# Altium schematic sheet 28pins_schematic.SchDoc (part 3 of 3)
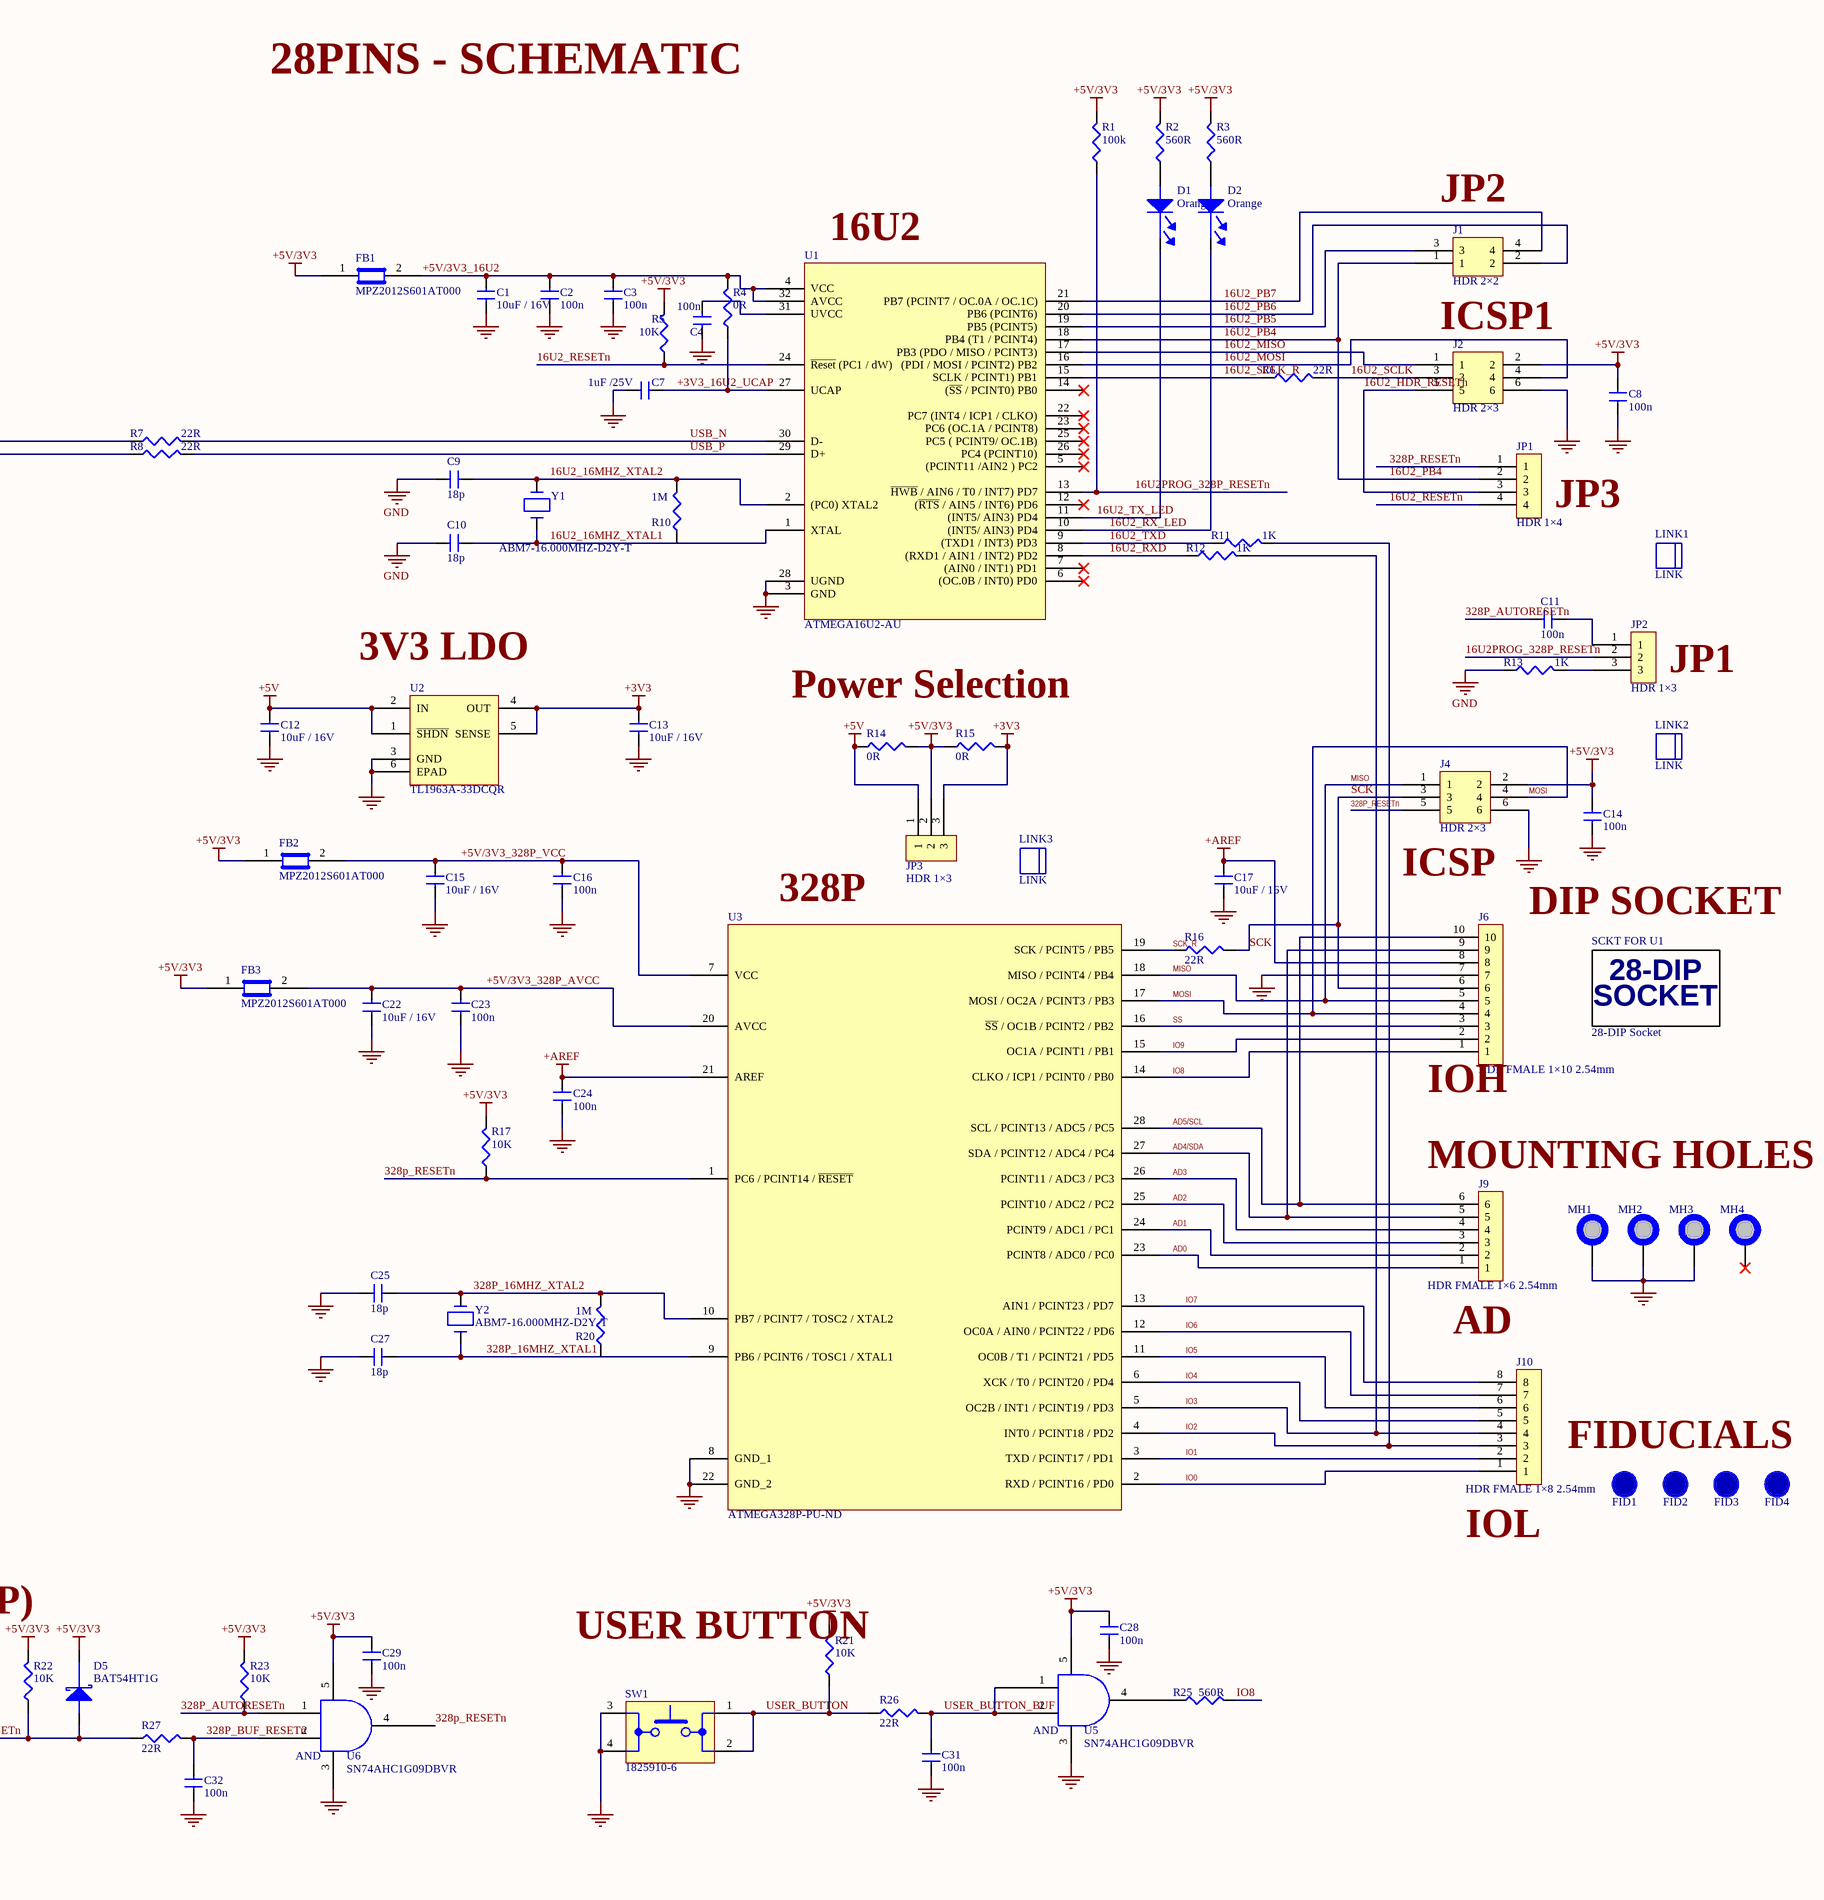
[diagram p3: 28pins_schematic.SchDoc, right]

## Library data of the parts (continued)
SW1 SW2 = 1825910-6: Alcoswitch, Switch, Pushbutton, Tactile, SPST, 50mA, Thru Hole, 6mm; Manufacturer: TE Connectivity Alcoswitch; Categories: Switches; Circuit: SPST-NO; Switch Function: Off-Mom; Contact Rating @ Voltage: 0.05A @ 24VDC; Actuator Type: Standard; Actuator Height off PCB, Vertical: 5.00mm; Actuator Orientation: Top Actuated; Outline: 6.00mm x 6.00mm; Illumination: Non-Illuminated; Operating Force: 160gf; Actuator Material: Polybutylene Terephthalate (PBT); Switch Travel: 0.25mm; Mechanical Life: 100,000 Cycles; Supplier 1: Digikey; Manufacturer Part Number: 1825910-6; Stock 1: 36154; Pricing 1: 1=0.13, 10=0.125, 25=0.1184, 100=0.1078, 250=0.1013, 750=0.0927, 1500=0.0776, 3000=0.0754, 5250=0.0711 (USD); Series: FSMJ; Packaging: Bulk; Part Status: Active; Mounting Type: Through Hole; Actuator Length, Right Angle: -; Termination Style: PC Pin; Illumination Type, Color: -; Illumination Voltage (Nominal): -; Ingress Protection: -; Features: -; Operating Temperature: -35°C ~ 85°C; ComponentLink1URL: https://datasheet.ciiva.com/30199/1825910-6rqpn1825910-6-30199520.pdf?src-supplier=Onlinecomponents.com; ComponentLink1Description: https://datasheet.ciiva.com/30199/1825910-6rqpn1825910-6-30199520.pdf?src-supplier=Onlinecomponents.com; ComponentLink2URL: https://datasheet.ciiva.com/15184/getdatasheetpartid-395915-15184509.pdf?src-supplier=Verical; ComponentLink2Description: https://datasheet.ciiva.com/15184/getdatasheetpartid-395915-15184509.pdf?src-supplier=Verical; Supplier Part Number 1: 450-1650-ND
U1 = ATMEGA16U2-AUR (2): Risc Microcontroller, 8-BIT, Flash, AVR Risc Cpu, 16MHZ, Cmos, PQFP32; Manufacturer: Microchip; Categories: Integrated Circuits (ICs); Connectivity: SPI, UART/USART, USB; Peripherals: Brown-out Detect/Reset, POR, PWM, WDT; Number of I/O: 22; Program Memory Size: 16KB (8K x 16); EEPROM Size: 512 x 8; Voltage - Supply (Vcc/Vdd): 2.7V ~ 5.5V; Oscillator Type: Internal; Supplier 1: Digikey; Manufacturer Part Number: ATMEGA16U2-AUR; Stock 1: 10662; Pricing 1: 1=3.34, 25=3.06, 100=2.75 (USD); Series: AVR® ATmega; Packaging: Digi-Reel®; Part Status: Active; Core Processor: AVR; Core Size: 8-Bit; Speed: 16MHz; Program Memory Type: FLASH; RAM Size: 512 x 8; Data Converters: -; Operating Temperature: -40°C ~ 85°C; Mounting Type: Surface Mount; Package / Case: 32-TQFP; Supplier Device Package: 32-TQFP (7x7); Base Part Number: ATMEGA16U2; ComponentLink1URL: http://www.microchip.com/mymicrochip/filehandler.aspx?ddocname=en590463&src-supplier=Digikey; ComponentLink1Description: http://www.microchip.com/mymicrochip/filehandler.aspx?ddocname=en590463&src-supplier=Digikey; ComponentLink2URL: https://datasheet.octopart.com/ATMEGA16U2-AUR-Microchip-datasheet-14435305.pdf?src-supplier=Electro+Sonic; ComponentLink2Description: https://datasheet.octopart.com/ATMEGA16U2-AUR-Microchip-datasheet-14435305.pdf?src-supplier=Electro+Sonic; Supplier Part Number 1: ATMEGA16U2-AURCT-ND
U2 = TL1963A-33DCQR: LDO Regulator Pos 3.3V 1.5A 6-Pin(5+Tab) SOT-223 T/R; Manufacturer: Texas Instruments; EDA / CAD Models: Download from Accelerated Designs; Regulator Topology: Positive Fixed; Voltage - Dropout (Typical): 0.34V @ 1.5A; Number of Regulators: 1; Voltage - Input: Up to 20V; Current - Limit (Min): 1.6A; Online Catalog: 3.1V to 3.3V; Other Names: 296-24534-6; Supplier 1: Digikey; Manufacturer Part Number: TL1963A-33DCQR; Stock 1: 9260; Pricing 1: 1=3.45, 10=3.098, 25=2.9292, 100=2.5387, 250=2.4085, 500=2.1611, 1000=1.8227 (USD); Standard Package: 1; Category: Integrated Circuits (ICs); Family: PMIC - Voltage Regulators - Linear; Series: -; Packaging: Digi-Reel®; Voltage - Output: 3.3V; Current - Output: 1.5A; Operating Temperature: -40°C ~ 125°C; Mounting Type: Surface Mount; Package / Case: SOT-223-6; Supplier Device Package: SOT-223-6; ComponentLink1URL: https://datasheet.ciiva.com/2046/tl1963a-2046162.pdf?src-supplier=Digikey; ComponentLink1Description: https://datasheet.ciiva.com/2046/tl1963a-2046162.pdf?src-supplier=Digikey; ComponentLink2URL: https://datasheet.ciiva.com/2046/tl1963a-2046161.pdf?src-supplier=Digikey; ComponentLink2Description: https://datasheet.ciiva.com/2046/tl1963a-2046161.pdf?src-supplier=Digikey; ComponentLink3URL: https://datasheet.ciiva.com/2046/tl1963a-2046163.pdf?src-supplier=Digikey; ComponentLink3Description: https://datasheet.ciiva.com/2046/tl1963a-2046163.pdf?src-supplier=Digikey; Supplier Part Number 1: 296-24534-1-ND
U3 = ATMEGA328P-PU: Microchip - ATMEGA328P-PU - Microcontroller Mcu, 8 Bit, Atmega, 20MHZ, DIP-28; Manuf. Code: ATM; Series (embedded microcontroller): AVR® ATmega; Core size: 8-Bit; Processor core: AVR; Oscillator type: Internal; Peripherals: Brown-out Detect/Reset, POR, PWM, WDT; I/O number: 23; Program memory type: FLASH; Supply voltage (max.): 5.5 V; Supply voltage (min.): 1.8 V; Data converter (embedded microcontroller): A/D 6x10b; EEPROM size: 1 K x 8; Connectivity: I²C, SPI, UART/USART; Program memory size: 32 KB (16 K x 16); RAM size: 2 K x 8; Casing: PDIP 28; Supplier 1: Digikey; Manufacturer: Microchip; Manufacturer Part Number: ATMEGA328P-PU; Stock 1: 83191; Pricing 1: 1=2.89, 25=2.65, 100=2.39 (USD); Type: ATMEGA328P-PU; Clock speed: 20 MHz; Max. operating temperature: +85 °C; Operating temperature (min.): -40 °C; ComponentLink1URL: https://datasheet.ciiva.com/1157/1684409-1157696.pdf?src-supplier=Element14; ComponentLink1Description: https://datasheet.ciiva.com/1157/1684409-1157696.pdf?src-supplier=Element14; ComponentLink2URL: https://datasheet.ciiva.com/29119/155197-da-01-en-microcontr-atmega328p-pu-8bit-pdip-28-29119593.pdf?src-supplier=Conrad; ComponentLink2Description: https://datasheet.ciiva.com/29119/155197-da-01-en-microcontr-atmega328p-pu-8bit-pdip-28-29119593.pdf?src-supplier=Conrad; ComponentLink3URL: https://datasheet.ciiva.com/15213/getdatasheetpartid-318533-15213133.pdf?src-supplier=Verical; ComponentLink3Description: https://datasheet.ciiva.com/15213/getdatasheetpartid-318533-15213133.pdf?src-supplier=Verical; Supplier Part Number 1: ATMEGA328P-PU-ND
U4-U7 = SN74AHC1G09DBVR: 1-ch, 2-input 2-V to 5.5-V high-speed (9 ns) AND gate with open-drain outputs 5-SOT-23 -55 to 125; Manufacturer: Texas Instruments; Categories: Integrated Circuits (ICs); Number of Circuits: 1; Number of Inputs: 2; Voltage - Supply: 2V ~ 5.5V; Current - Quiescent (Max): 1µA; Current - Output High, Low: -, 8mA; Logic Level - Low: 0.5V ~ 1.65V; Logic Level - High: 1.5V ~ 3.85V; Max Propagation Delay @ V, Max CL: 7.5ns @ 5V, 50pF; Supplier 1: Digikey; Manufacturer Part Number: SN74AHC1G09DBVR; Stock 1: 11293; Pricing 1: 1=0.34, 10=0.253, 25=0.2212, 100=0.1432, 250=0.1186, 500=0.0948, 1000=0.0727 (USD); Series: 74AHC; Packaging: Digi-Reel®; Part Status: Active; Logic Type: AND Gate; Features: Open Drain; Operating Temperature: -55°C ~ 125°C; Mounting Type: Surface Mount; Supplier Device Package: SOT-23-5; Package / Case: SC-74A, SOT-753; Base Part Number: SN74AHC1; ComponentLink1URL: https://datasheet.ciiva.com/1864/sn74ahc1g09-1864411.pdf?src-supplier=Digikey; ComponentLink1Description: https://datasheet.ciiva.com/1864/sn74ahc1g09-1864411.pdf?src-supplier=Digikey; ComponentLink2URL: https://datasheet.ciiva.com/1864/sn74ahc1g09-1864410.pdf?src-supplier=Digikey; ComponentLink2Description: https://datasheet.ciiva.com/1864/sn74ahc1g09-1864410.pdf?src-supplier=Digikey; ComponentLink3URL: https://datasheet.ciiva.com/1864/sn74ahc1g09-1864412.pdf?src-supplier=Digikey; ComponentLink3Description: https://datasheet.ciiva.com/1864/sn74ahc1g09-1864412.pdf?src-supplier=Digikey; Supplier Part Number 1: 296-29202-1-ND
Y1 Y2 = ABM7-16.000MHZ-D2Y-T: Crystal 16MHz ±20ppm (Tol) ±30ppm (Stability) 18pF FUND 50Ohm 2-Pin Mini-CSMD T/R; Manufacturer: Abracon; Case Height: 1.4 mm; Case Length: 6 mm; Case Width: 3.3 mm; ESR: 50 Ohms; Supplier 1: Digikey; Manufacturer Part Number: ABM7-16.000MHZ-D2Y-T; Stock 1: 42052; Pricing 1: 1=0.63, 10=0.545, 50=0.4912, 100=0.4698, 500=0.4237 (USD); Brand: ABRACON; Dimensions: 3.3 mm W x 6 mm L x 1.4 mm H; Frequency: 16 MHz; Frequency Stability: 30 PPM; Load Capacitance: 18 pF; Package / Case: 6 mm x 3.3 mm; Operating Temperature Range: - 40 C to + 85 C; Mounting Style: SMD/SMT; Factory Pack Quantity: 1000; Product Category: Crystals; RoHS: Details; Tolerance: 20 PPM; Termination Style: SMD/SMT; Packaging: Reel; Series: ABM7; Type: Ceramic Micro Miniature Microprocessor Crystal; ComponentLink1URL: https://datasheet.ciiva.com/15116/getdatasheetpartid-721624-15116835.pdf?src-supplier=Verical; ComponentLink1Description: https://datasheet.ciiva.com/15116/getdatasheetpartid-721624-15116835.pdf?src-supplier=Verical; ComponentLink2URL: https://datasheet.ciiva.com/5788/abm7-5788054.pdf?src-supplier=Farnell; ComponentLink2Description: https://datasheet.ciiva.com/5788/abm7-5788054.pdf?src-supplier=Farnell; ComponentLink3URL: https://datasheet.ciiva.com/7998/947971-7998600.pdf?src-supplier=Element14; ComponentLink3Description: https://datasheet.ciiva.com/7998/947971-7998600.pdf?src-supplier=Element14; ComponentLink4URL: https://datasheet.ciiva.com/22658/947971-22658293.pdf?src-supplier=Element14; ComponentLink4Description: https://datasheet.ciiva.com/22658/947971-22658293.pdf?src-supplier=Element14; ComponentLink5URL: https://datasheet.ciiva.com/46385/947971-46385243.pdf?src-supplier=Element14; ComponentLink5Description: https://datasheet.ciiva.com/46385/947971-46385243.pdf?src-supplier=Element14; ComponentLink6URL: https://datasheet.ciiva.com/18649/abm7-18649866.pdf?src-supplier=Digikey; ComponentLink6Description: https://datasheet.ciiva.com/18649/abm7-18649866.pdf?src-supplier=Digikey; ComponentLink7URL: https://datasheet.ciiva.com/18649/abm7-18649865.pdf?src-supplier=Digikey; ComponentLink7Description: https://datasheet.ciiva.com/18649/abm7-18649865.pdf?src-supplier=Digikey; ComponentLink8URL: https://datasheet.ciiva.com/18649/abm7-18649867.pdf?src-supplier=Digikey; ComponentLink8Description: https://datasheet.ciiva.com/18649/abm7-18649867.pdf?src-supplier=Digikey; ComponentLink9URL: https://datasheet.ciiva.com/16383/abm7-16383174.pdf?src-supplier=Future+Electronics; ComponentLink9Description: https://datasheet.ciiva.com/16383/abm7-16383174.pdf?src-supplier=Future+Electronics; ComponentLink10URL: https://datasheet.ciiva.com/26941/getdatasheetpartid-719818-26941724.pdf?src-supplier=Verical; ComponentLink10Description: https://datasheet.ciiva.com/26941/getdatasheetpartid-719818-26941724.pdf?src-supplier=Verical; Supplier Part Number 1: 535-9840-6-ND
Z1 Z2 = CG0603MLC-05E: ESD Suppressor Multilayer Varistor 5V Automotive 2-Pin Case 0603(1608Metric) T/R; Manufacturer: Bourns; Capacitance: 0.5 pF; Channels: 1 Channel; Case Width: 0.8 mm; Clamping Voltage: 20 V; Current Rating: 50 nA; Supplier 1: Digikey; Manufacturer Part Number: CG0603MLC-05E; Stock 1: 149734; Pricing 1: 1=0.45, 10=0.336, 25=0.3032, 100=0.2096, 250=0.1765, 500=0.1434, 1000=0.1103, 2500=0.0993 (USD); Brand: Bourns; Case Code - in: 0603; Case Code - mm: 1608; Operating Voltage: 5 V; Operating Temperature Range: - 40 C to + 85 C; Dimensions: 0.8 mm W x 1.6 mm L x 0.8 mm H; Mounting: SMD/SMT; Factory Pack Quantity: 5000; Product Category: Varistors; RoHS: Details; Product: MLV; Voltage Rating DC: 5 V; Termination Style: SMD/SMT; Packaging: Reel; Package / Case: 0603 (1608 metric); Series: MLC; Tradename: ChipGuard; Voltage: 5 V; Width: 0.8 mm; ComponentLink1URL: https://datasheet.ciiva.com/27747/1163231-27747629.pdf?src-supplier=Jameco; ComponentLink1Description: https://datasheet.ciiva.com/27747/1163231-27747629.pdf?src-supplier=Jameco; ComponentLink2URL: https://datasheet.ciiva.com/1278/1785244-1278701.pdf?src-supplier=Element14; ComponentLink2Description: https://datasheet.ciiva.com/1278/1785244-1278701.pdf?src-supplier=Element14; ComponentLink3URL: https://datasheet.ciiva.com/22696/1785244-22696318.pdf?src-supplier=Element14; ComponentLink3Description: https://datasheet.ciiva.com/22696/1785244-22696318.pdf?src-supplier=Element14; ComponentLink4URL: https://datasheet.ciiva.com/8084/mlc-8084047.pdf?src-supplier=Avnet; ComponentLink4Description: https://datasheet.ciiva.com/8084/mlc-8084047.pdf?src-supplier=Avnet; ComponentLink5URL: https://datasheet.ciiva.com/6991/mlc-6991834.pdf?src-supplier=Digikey; ComponentLink5Description: https://datasheet.ciiva.com/6991/mlc-6991834.pdf?src-supplier=Digikey; ComponentLink6URL: https://datasheet.ciiva.com/6991/mlc-6991836.pdf?src-supplier=Digikey; ComponentLink6Description: https://datasheet.ciiva.com/6991/mlc-6991836.pdf?src-supplier=Digikey; ComponentLink7URL: https://datasheet.ciiva.com/6991/mlc-6991832.pdf?src-supplier=Digikey; ComponentLink7Description: https://datasheet.ciiva.com/6991/mlc-6991832.pdf?src-supplier=Digikey; ComponentLink8URL: https://datasheet.ciiva.com/30070/mlc-30070503.pdf?src-supplier=Onlinecomponents.com; ComponentLink8Description: https://datasheet.ciiva.com/30070/mlc-30070503.pdf?src-supplier=Onlinecomponents.com; Supplier Part Number 1: CG0603MLC-05ECT-ND